# Altium schematic sheet SmartCanBus.SchDoc
size A4
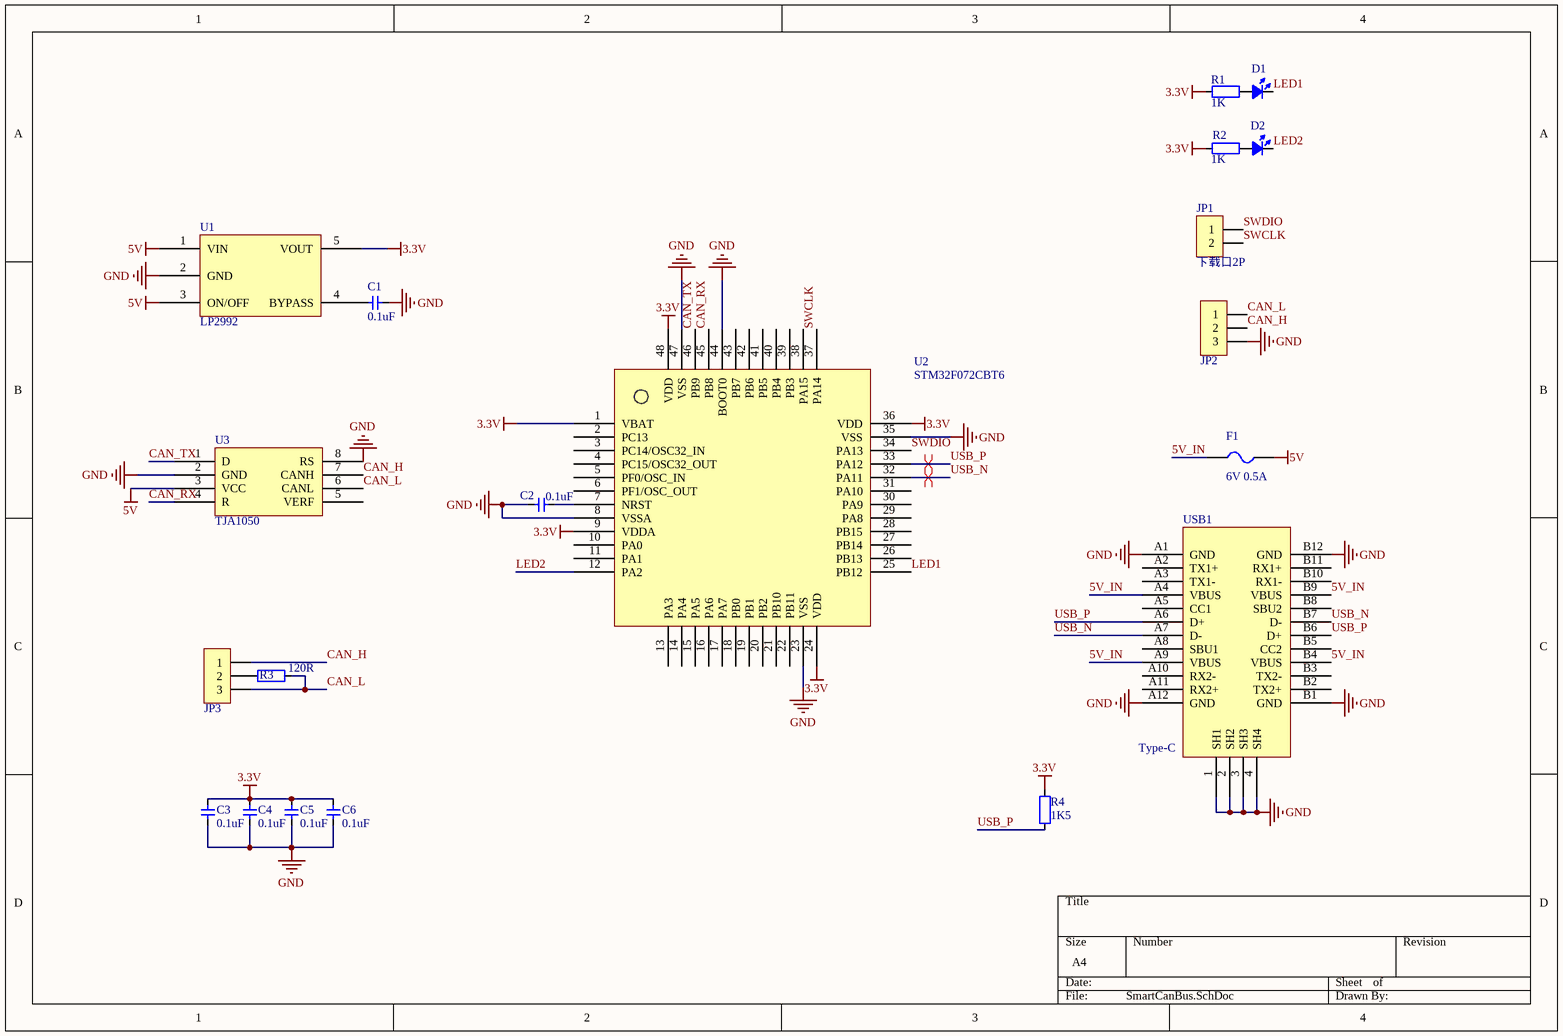
[diagram p0: SmartCanBus.SchDoc]

## Parts
C1  0.1uF  [0603_CAP]
C2  0.1uF  [0603_CAP]
C3  0.1uF  [0603_CAP]
C4  0.1uF  [0603_CAP]
C5  0.1uF  [0603_CAP]
C6  0.1uF  [0603_CAP]
D1  LED-0603  [0603_LED_RED]  (value not drawn)
D2  LED-0603  [0603_LED_BLUE]  (value not drawn)
F1  6V 0.5A  [FU 0805]
JP1  下载口2P  [下载口2P]
JP2  HDR-1X3  [KF128-3.81-3P]  (value not drawn)
JP3  HDR-1X3  [HDR2.54-LI-3P]  (value not drawn)
R1  1K  [0603_RES]
R2  1K  [0603_RES]
R3  value 120R  [0603_RES]  (hidden comment: 1K)
R4  1K5  [0603_RES]
U1  LP2992  [SOT23-5N]
U2  STM32F072CBT6  [LQFP-48]
U3  TJA1050  [SOIC-8 - duplicate]
USB1  Type-C  [Type-C-TOP]

## Nets
3.3V: C3.1 C4.1 C5.1 C6.1 R1.1 R2.1 R4.2 U1.5(VOUT) U2.1(VBAT) U2.9(VDDA) U2.24(VDD) U2.36(VDD) U2.48(VDD)
5V: F1.2 U1.1(VIN) U1.3(ON/OFF) U3.3(VCC)
GND: C1.1 C2.1 C3.2 C4.2 C5.2 C6.2 JP2.3 U1.2(GND) U2.8(VSSA) U2.23(VSS) U2.35(VSS) U2.44(BOOT0) U2.47(VSS) U3.2(GND) U3.8(RS) USB1.1(SH1) USB1.2(SH2) USB1.3(SH3) USB1.4(SH4) USB1.A1(GND) USB1.A12(GND) USB1.B1(GND) USB1.B12(GND)
5V_IN: F1.1 USB1.A4(VBUS) USB1.A9(VBUS) USB1.B4(VBUS) USB1.B9(VBUS)
CAN_H: JP2.2 JP3.1 U3.7(CANH)
CAN_L: JP2.1 JP3.3 R3.2 U3.6(CANL)
CAN_RX: U2.45(PB8) U3.4(R)
CAN_TX: U2.46(PB9) U3.1(D)
LED1: D1.2(K) U2.25(PB12)
LED2: D2.2(K) U2.12(PA2)
SWCLK: JP1.2 U2.37(PA14)
SWDIO: JP1.1 U2.34(PA13)
USB_N: U2.32(PA11) USB1.A7(D-) USB1.B7(D-)
USB_P: R4.1 U2.33(PA12) USB1.A6(D+) USB1.B6(D+)
NetC1_2: C1.2 U1.4(BYPASS)
NetC2_2: C2.2 U2.7(NRST)
NetD1_1: D1.1(A) R1.2
NetD2_1: D2.1(A) R2.2
NetJP3_2: JP3.2 R3.1

Not connected (* = marked no-connect by the designer): U2 2(PC13) 3(PC14/OSC32_IN) 4(PC15/OSC32_OUT) 5(PF0/OSC_IN) 6(PF1/OSC_OUT) 10(PA0) 11(PA1) 13(PA3) 14(PA4) 15(PA5) 16(PA6) 17(PA7) 18(PB0) 19(PB1) 20(PB2) 21(PB10) 22(PB11) 26(PB13) 27(PB14) 28(PB15) 29(PA8) 30(PA9) 31(PA10) 38(PA15) 39(PB3) 40(PB4) 41(PB5) 42(PB6) 43(PB7); U3 5(VERF); USB1 A2(TX1+) A3(TX1-) A5(CC1) A8(SBU1) A10(RX2-) A11(RX2+) B2(TX2+) B3(TX2-) B5(CC2) B8(SBU2) B10(RX1-) B11(RX1+)

## Layout directives
differential pair: USB_N, USB_P

## Library data of the parts
C1-C6 = 电容-0603: 电容; Value: 0.1u
D1 = 二极管-0603-RED: 发光二极管
D2 = 二极管-0603-BLUE: 发光二极管
F1 = FU: 贴片保险丝; 版权归属: 封装库来自淘宝卖家 ID：黄晶宝石; BOM名称: 贴片保险丝; 学习资源: https://shop463601444.taobao.com
JP1 = 接插件-下载口2P: 下载口2P SWD
JP2 JP3 = Header 3: 3P接插件; 版权归属: 封装库来自淘宝 ID：黄晶宝石; BOM名称: 3P接插件; 学习资源: https://shop463601444.taobao.com
R1-R4 = 电阻-0603: 电阻
  R1 R2: Value: 1K
  R4: Value: 1K5
U1 = LP2992: 电源芯片
U2 = STM32F072CBT6: 48MHZ Crotex-M0 32位单片机 LQFP-48_7x7x05P
U3 = TJA1050: CAN芯片
USB1 = 接插件-USB-Type-C